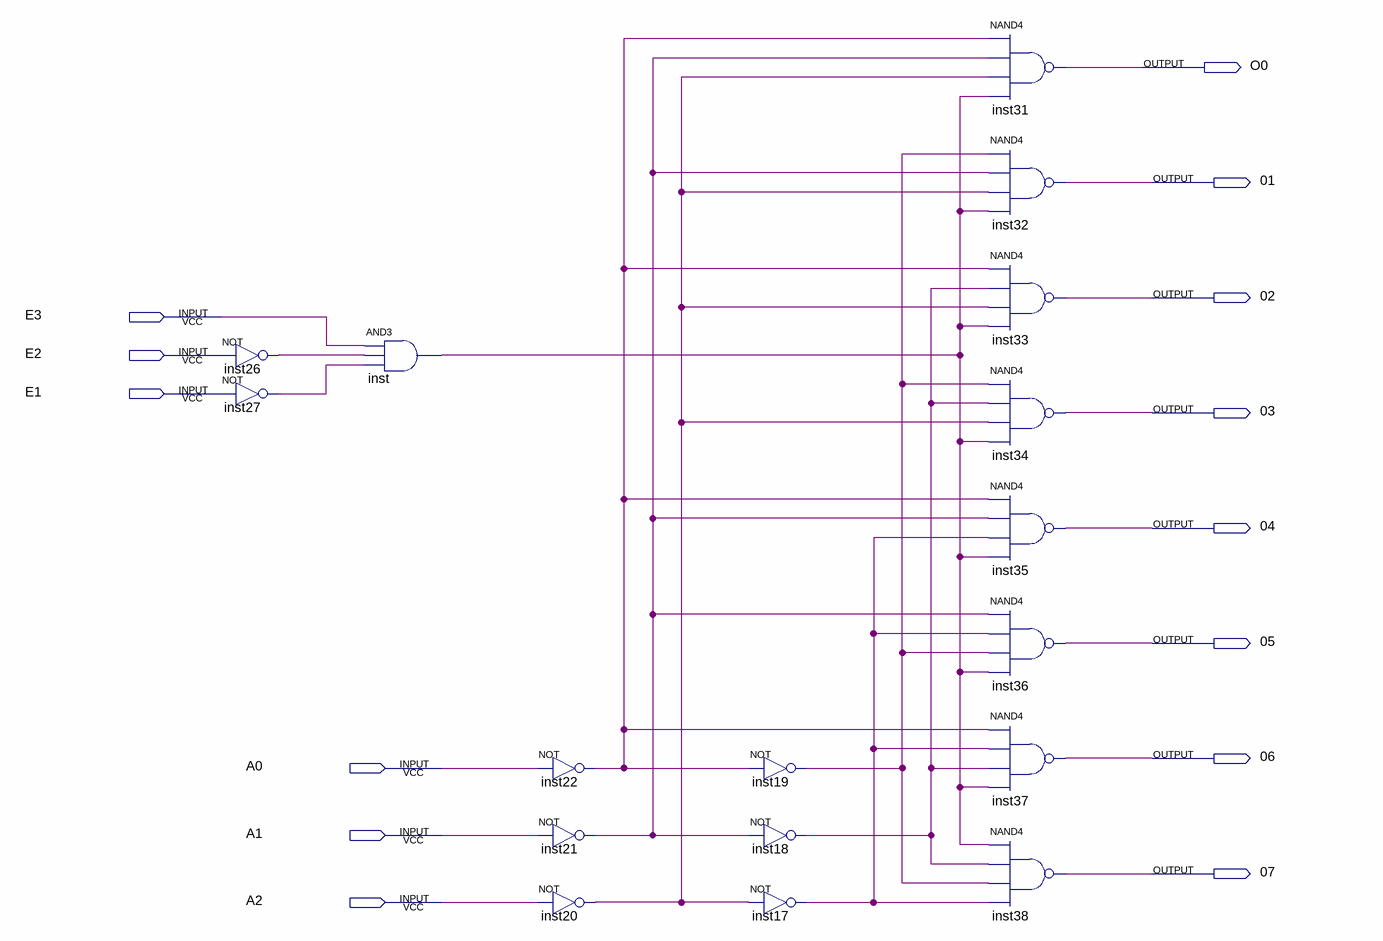
[diagram p0: schematic sheet]
// Quartus schematic Block1.bdf as structural Verilog: 17 symbols, 14 pins
module Block1 (
  input  E3,
  input  E2,
  input  E1,
  input  A0,
  input  A1,
  input  A2,
  output O0,
  output \01 ,
  output \02 ,
  output \03 ,
  output \04 ,
  output \05 ,
  output \06 ,
  output \07 
);

  wire inst17_out, inst18_out, inst19_out, inst20_out, inst21_out, inst22_out, inst26_out, inst27_out,
       inst_out;

  not inst26 (inst26_out, E2);
  not inst27 (inst27_out, E1);
  and inst (inst_out, E3, inst26_out, inst27_out);
  not inst22 (inst22_out, A0);
  not inst21 (inst21_out, A1);
  not inst20 (inst20_out, A2);
  not inst19 (inst19_out, inst22_out);
  not inst18 (inst18_out, inst21_out);
  not inst17 (inst17_out, inst20_out);
  nand inst31 (O0, inst22_out, inst21_out, inst20_out, inst_out);
  nand inst32 (\01 , inst19_out, inst21_out, inst20_out, inst_out);
  nand inst33 (\02 , inst22_out, inst18_out, inst20_out, inst_out);
  nand inst34 (\03 , inst19_out, inst18_out, inst20_out, inst_out);
  nand inst35 (\04 , inst22_out, inst21_out, inst17_out, inst_out);
  nand inst36 (\05 , inst21_out, inst17_out, inst19_out, inst_out);
  nand inst37 (\06 , inst22_out, inst17_out, inst18_out, inst_out);
  nand inst38 (\07 , inst_out, inst18_out, inst19_out, inst17_out);
endmodule
